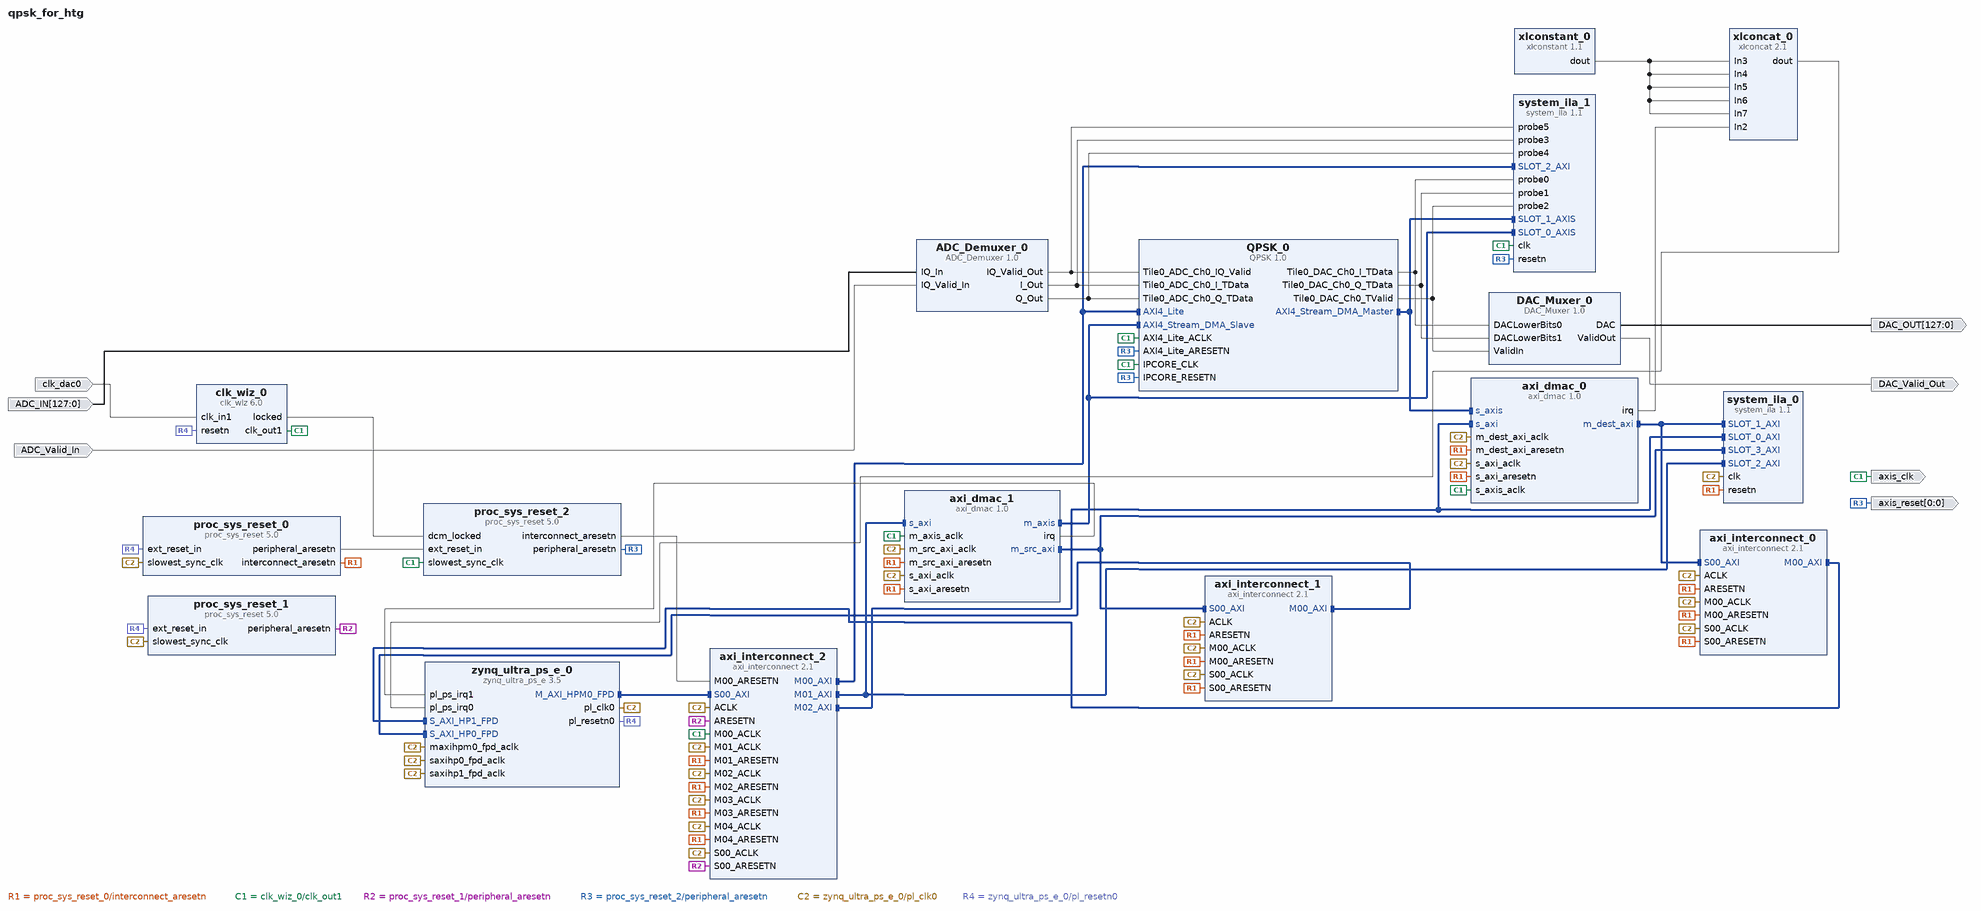
[diagram p0: block diagram of the top level]
# Vivado block design qpsk_for_htg, xczu48dr-ffvg1517-2-e, Vivado 2024.2
create_bd_design qpsk_for_htg

create_bd_port -dir I -type clk clk_dac0
set_property -dict {CONFIG.FREQ_HZ 128000000} [get_bd_ports clk_dac0]
create_bd_port -dir I -from 127 -to 0 ADC_IN
create_bd_port -dir I ADC_Valid_In
create_bd_port -dir O -from 0 -to 0 -type rst axis_reset
create_bd_port -dir O -from 127 -to 0 DAC_OUT
create_bd_port -dir O DAC_Valid_Out
create_bd_port -dir O -type clk axis_clk

create_bd_cell -type ip -vlnv xilinx.com:ip:zynq_ultra_ps_e:3.5 zynq_ultra_ps_e_0
set_property -dict [list \
  CONFIG.PSU__DDR_HIGH_ADDRESS_GUI_ENABLE 0 \
  CONFIG.PSU__MAXIGP0__DATA_WIDTH 128 \
  CONFIG.PSU__USE__IRQ0 1 \
  CONFIG.PSU__USE__IRQ1 1 \
  CONFIG.PSU__USE__M_AXI_GP0 1 \
  CONFIG.PSU__USE__M_AXI_GP2 0 \
  CONFIG.PSU__USE__S_AXI_GP2 1 \
  CONFIG.PSU__USE__S_AXI_GP3 1 \
] [get_bd_cells zynq_ultra_ps_e_0]
# 6 more settings of zynq_ultra_ps_e_0 are not shown: defaults, MIO pin electricals, DDR timing, and values the tool derives
create_bd_cell -type ip -vlnv xilinx.com:ip:axi_interconnect:2.1 axi_interconnect_0
set_property -dict {CONFIG.NUM_MI 1} [get_bd_cells axi_interconnect_0]
create_bd_cell -type ip -vlnv xilinx.com:ip:axi_interconnect:2.1 axi_interconnect_1
set_property -dict {CONFIG.NUM_MI 1} [get_bd_cells axi_interconnect_1]
create_bd_cell -type ip -vlnv xilinx.com:ip:axi_interconnect:2.1 axi_interconnect_2
set_property -dict {CONFIG.NUM_MI 5 CONFIG.NUM_SI 1} [get_bd_cells axi_interconnect_2]
create_bd_cell -type ip -vlnv analog.com:user:axi_dmac:1.0 axi_dmac_0
set_property -dict [list \
  CONFIG.ASYNC_CLK_DEST_REQ false \
  CONFIG.ASYNC_CLK_REQ_SRC true \
  CONFIG.ASYNC_CLK_SRC_DEST true \
  CONFIG.DMA_DATA_WIDTH_DEST 32 \
  CONFIG.DMA_DATA_WIDTH_SRC 32 \
  CONFIG.DMA_TYPE_SRC 1 \
  CONFIG.FIFO_SIZE 32 \
  CONFIG.MAX_BYTES_PER_BURST 512 \
] [get_bd_cells axi_dmac_0]
create_bd_cell -type ip -vlnv fau.edu:ip:QPSK:1.0 QPSK_0
create_bd_cell -type ip -vlnv analog.com:user:axi_dmac:1.0 axi_dmac_1
set_property -dict [list \
  CONFIG.ASYNC_CLK_DEST_REQ true \
  CONFIG.ASYNC_CLK_REQ_SRC false \
  CONFIG.ASYNC_CLK_SRC_DEST true \
  CONFIG.DMA_DATA_WIDTH_DEST 32 \
  CONFIG.DMA_DATA_WIDTH_SRC 32 \
  CONFIG.DMA_TYPE_DEST 1 \
  CONFIG.DMA_TYPE_SRC 0 \
  CONFIG.FIFO_SIZE 32 \
  CONFIG.MAX_BYTES_PER_BURST 512 \
] [get_bd_cells axi_dmac_1]
create_bd_cell -type ip -vlnv xilinx.com:ip:proc_sys_reset:5.0 proc_sys_reset_0
create_bd_cell -type ip -vlnv xilinx.com:ip:proc_sys_reset:5.0 proc_sys_reset_1
create_bd_cell -type ip -vlnv xilinx.com:ip:clk_wiz:6.0 clk_wiz_0
set_property -dict [list \
  CONFIG.CLKIN1_JITTER_PS 100.0 \
  CONFIG.CLKOUT1_JITTER 110.723 \
  CONFIG.CLKOUT1_PHASE_ERROR 87.180 \
  CONFIG.CLKOUT1_REQUESTED_OUT_FREQ 128.000 \
  CONFIG.MMCM_CLKFBOUT_MULT_F 9.375 \
  CONFIG.MMCM_CLKIN1_PERIOD 7.813 \
  CONFIG.MMCM_CLKOUT0_DIVIDE_F 9.375 \
  CONFIG.OVERRIDE_MMCM false \
  CONFIG.RESET_PORT resetn \
  CONFIG.RESET_TYPE ACTIVE_LOW \
] [get_bd_cells clk_wiz_0]
create_bd_cell -type ip -vlnv xilinx.com:ip:xlconcat:2.1 xlconcat_0
set_property -dict {CONFIG.NUM_PORTS 8} [get_bd_cells xlconcat_0]
create_bd_cell -type ip -vlnv xilinx.com:ip:xlconstant:1.1 xlconstant_0
create_bd_cell -type ip -vlnv xilinx.com:ip:proc_sys_reset:5.0 proc_sys_reset_2
create_bd_cell -type ip -vlnv mathworks.com:user:ADC_Demuxer:1.0 ADC_Demuxer_0
set_property -dict {CONFIG.ISGEN3 true} [get_bd_cells ADC_Demuxer_0]
create_bd_cell -type ip -vlnv mathworks.com:user:DAC_Muxer:1.0 DAC_Muxer_0
set_property -dict {CONFIG.SAMPLESPERCLOCK 4} [get_bd_cells DAC_Muxer_0]
create_bd_cell -type ip -vlnv xilinx.com:ip:system_ila:1.1 system_ila_0
set_property -dict [list \
  CONFIG.C_DATA_DEPTH 4096 \
  CONFIG.C_NUM_MONITOR_SLOTS 4 \
  CONFIG.C_SLOT 3 \
  CONFIG.C_SLOT_1_INTF_TYPE xilinx.com:interface:aximm_rtl:1.0 \
  CONFIG.C_SLOT_3_INTF_TYPE xilinx.com:interface:aximm_rtl:1.0 \
] [get_bd_cells system_ila_0]
create_bd_cell -type ip -vlnv xilinx.com:ip:system_ila:1.1 system_ila_1
set_property -dict [list \
  CONFIG.C_DATA_DEPTH 4096 \
  CONFIG.C_MON_TYPE MIX \
  CONFIG.C_NUM_MONITOR_SLOTS 3 \
  CONFIG.C_NUM_OF_PROBES 6 \
  CONFIG.C_SLOT 1 \
  CONFIG.C_SLOT_0_INTF_TYPE xilinx.com:interface:axis_rtl:1.0 \
  CONFIG.C_SLOT_1_INTF_TYPE xilinx.com:interface:axis_rtl:1.0 \
] [get_bd_cells system_ila_1]

# ---- connections ----

connect_bd_intf_net [get_bd_intf_pins QPSK_0/AXI4_Stream_DMA_Master] [get_bd_intf_pins axi_dmac_0/s_axis]
connect_bd_intf_net [get_bd_intf_pins QPSK_0/AXI4_Stream_DMA_Master] [get_bd_intf_pins system_ila_1/SLOT_1_AXIS]
connect_bd_intf_net [get_bd_intf_pins axi_dmac_0/m_dest_axi] [get_bd_intf_pins axi_interconnect_0/S00_AXI]
connect_bd_intf_net [get_bd_intf_pins axi_dmac_0/m_dest_axi] [get_bd_intf_pins system_ila_0/SLOT_1_AXI]
connect_bd_intf_net [get_bd_intf_pins axi_dmac_1/m_axis] [get_bd_intf_pins QPSK_0/AXI4_Stream_DMA_Slave]
connect_bd_intf_net [get_bd_intf_pins axi_dmac_1/m_axis] [get_bd_intf_pins system_ila_1/SLOT_0_AXIS]
connect_bd_intf_net [get_bd_intf_pins axi_dmac_1/m_src_axi] [get_bd_intf_pins axi_interconnect_1/S00_AXI]
connect_bd_intf_net [get_bd_intf_pins axi_dmac_1/m_src_axi] [get_bd_intf_pins system_ila_0/SLOT_3_AXI]
connect_bd_intf_net [get_bd_intf_pins axi_interconnect_0/M00_AXI] [get_bd_intf_pins zynq_ultra_ps_e_0/S_AXI_HP1_FPD]
connect_bd_intf_net [get_bd_intf_pins axi_interconnect_1/M00_AXI] [get_bd_intf_pins zynq_ultra_ps_e_0/S_AXI_HP0_FPD]
connect_bd_intf_net [get_bd_intf_pins QPSK_0/AXI4_Lite] [get_bd_intf_pins axi_interconnect_2/M00_AXI]
connect_bd_intf_net [get_bd_intf_pins QPSK_0/AXI4_Lite] [get_bd_intf_pins system_ila_1/SLOT_2_AXI]
connect_bd_intf_net [get_bd_intf_pins axi_dmac_1/s_axi] [get_bd_intf_pins axi_interconnect_2/M01_AXI]
connect_bd_intf_net [get_bd_intf_pins axi_dmac_1/s_axi] [get_bd_intf_pins system_ila_0/SLOT_2_AXI]
connect_bd_intf_net [get_bd_intf_pins axi_dmac_0/s_axi] [get_bd_intf_pins axi_interconnect_2/M02_AXI]
connect_bd_intf_net [get_bd_intf_pins axi_dmac_0/s_axi] [get_bd_intf_pins system_ila_0/SLOT_0_AXI]
connect_bd_intf_net [get_bd_intf_pins zynq_ultra_ps_e_0/M_AXI_HPM0_FPD] [get_bd_intf_pins axi_interconnect_2/S00_AXI]
connect_bd_net [get_bd_pins ADC_Demuxer_0/IQ_Valid_Out] [get_bd_pins system_ila_1/probe5] [get_bd_pins QPSK_0/Tile0_ADC_Ch0_IQ_Valid]
connect_bd_net [get_bd_pins ADC_Demuxer_0/I_Out] [get_bd_pins system_ila_1/probe3] [get_bd_pins QPSK_0/Tile0_ADC_Ch0_I_TData]
connect_bd_net [get_bd_pins ADC_Demuxer_0/Q_Out] [get_bd_pins system_ila_1/probe4] [get_bd_pins QPSK_0/Tile0_ADC_Ch0_Q_TData]
connect_bd_net -net ARESETN_1 [get_bd_pins proc_sys_reset_0/interconnect_aresetn] \
  [get_bd_pins axi_interconnect_0/ARESETN] [get_bd_pins axi_interconnect_0/S00_ARESETN] \
  [get_bd_pins axi_interconnect_0/M00_ARESETN] [get_bd_pins axi_interconnect_2/M01_ARESETN] \
  [get_bd_pins axi_interconnect_2/M02_ARESETN] [get_bd_pins axi_interconnect_2/M03_ARESETN] \
  [get_bd_pins axi_interconnect_2/M04_ARESETN] [get_bd_pins axi_interconnect_1/M00_ARESETN] \
  [get_bd_pins axi_interconnect_1/S00_ARESETN] [get_bd_pins axi_interconnect_1/ARESETN] \
  [get_bd_pins axi_dmac_0/m_dest_axi_aresetn] [get_bd_pins axi_dmac_0/s_axi_aresetn] [get_bd_pins system_ila_0/resetn] \
  [get_bd_pins axi_dmac_1/s_axi_aresetn] [get_bd_pins axi_dmac_1/m_src_axi_aresetn]
connect_bd_net [get_bd_pins DAC_Muxer_0/DAC] [get_bd_ports DAC_OUT]
connect_bd_net [get_bd_pins DAC_Muxer_0/ValidOut] [get_bd_ports DAC_Valid_Out]
connect_bd_net -net IQ_In_0_1 [get_bd_ports ADC_IN] [get_bd_pins ADC_Demuxer_0/IQ_In]
connect_bd_net -net IQ_Valid_In_0_1 [get_bd_ports ADC_Valid_In] [get_bd_pins ADC_Demuxer_0/IQ_Valid_In]
connect_bd_net -net M00_ARESETN_1 [get_bd_pins proc_sys_reset_2/interconnect_aresetn] [get_bd_pins axi_interconnect_2/M00_ARESETN]
connect_bd_net [get_bd_pins QPSK_0/Tile0_DAC_Ch0_I_TData] [get_bd_pins DAC_Muxer_0/DACLowerBits0] [get_bd_pins system_ila_1/probe0]
connect_bd_net [get_bd_pins QPSK_0/Tile0_DAC_Ch0_Q_TData] [get_bd_pins DAC_Muxer_0/DACLowerBits1] [get_bd_pins system_ila_1/probe1]
connect_bd_net [get_bd_pins QPSK_0/Tile0_DAC_Ch0_TValid] [get_bd_pins DAC_Muxer_0/ValidIn] [get_bd_pins system_ila_1/probe2]
connect_bd_net [get_bd_pins axi_dmac_0/irq] [get_bd_pins xlconcat_0/In2]
connect_bd_net [get_bd_pins axi_dmac_1/irq] [get_bd_pins zynq_ultra_ps_e_0/pl_ps_irq1]
connect_bd_net -net clk_in1_0_1 [get_bd_ports clk_dac0] [get_bd_pins clk_wiz_0/clk_in1]
connect_bd_net [get_bd_pins clk_wiz_0/clk_out1] \
  [get_bd_ports axis_clk] [get_bd_pins axi_dmac_1/m_axis_aclk] [get_bd_pins axi_dmac_0/s_axis_aclk] \
  [get_bd_pins proc_sys_reset_2/slowest_sync_clk] [get_bd_pins axi_interconnect_2/M00_ACLK] [get_bd_pins system_ila_1/clk] \
  [get_bd_pins QPSK_0/IPCORE_CLK] [get_bd_pins QPSK_0/AXI4_Lite_ACLK]
connect_bd_net [get_bd_pins clk_wiz_0/locked] [get_bd_pins proc_sys_reset_2/dcm_locked]
connect_bd_net [get_bd_pins proc_sys_reset_0/peripheral_aresetn] [get_bd_pins proc_sys_reset_2/ext_reset_in]
connect_bd_net [get_bd_pins proc_sys_reset_1/peripheral_aresetn] [get_bd_pins axi_interconnect_2/ARESETN] [get_bd_pins axi_interconnect_2/S00_ARESETN]
connect_bd_net [get_bd_pins proc_sys_reset_2/peripheral_aresetn] \
  [get_bd_ports axis_reset] [get_bd_pins system_ila_1/resetn] [get_bd_pins QPSK_0/IPCORE_RESETN] \
  [get_bd_pins QPSK_0/AXI4_Lite_ARESETN]
connect_bd_net [get_bd_pins xlconcat_0/dout] [get_bd_pins zynq_ultra_ps_e_0/pl_ps_irq0]
connect_bd_net [get_bd_pins xlconstant_0/dout] \
  [get_bd_pins xlconcat_0/In3] [get_bd_pins xlconcat_0/In4] [get_bd_pins xlconcat_0/In5] [get_bd_pins xlconcat_0/In6] \
  [get_bd_pins xlconcat_0/In7]
connect_bd_net [get_bd_pins zynq_ultra_ps_e_0/pl_clk0] \
  [get_bd_pins axi_interconnect_2/ACLK] [get_bd_pins axi_interconnect_2/S00_ACLK] [get_bd_pins axi_interconnect_2/M01_ACLK] \
  [get_bd_pins axi_interconnect_2/M02_ACLK] [get_bd_pins axi_interconnect_2/M03_ACLK] \
  [get_bd_pins proc_sys_reset_1/slowest_sync_clk] [get_bd_pins axi_interconnect_2/M04_ACLK] \
  [get_bd_pins zynq_ultra_ps_e_0/saxihp0_fpd_aclk] [get_bd_pins zynq_ultra_ps_e_0/saxihp1_fpd_aclk] \
  [get_bd_pins axi_interconnect_0/ACLK] [get_bd_pins axi_interconnect_0/S00_ACLK] [get_bd_pins axi_interconnect_0/M00_ACLK] \
  [get_bd_pins axi_interconnect_1/ACLK] [get_bd_pins axi_interconnect_1/M00_ACLK] [get_bd_pins axi_interconnect_1/S00_ACLK] \
  [get_bd_pins axi_dmac_0/s_axi_aclk] [get_bd_pins axi_dmac_0/m_dest_axi_aclk] [get_bd_pins axi_dmac_1/s_axi_aclk] \
  [get_bd_pins axi_dmac_1/m_src_axi_aclk] [get_bd_pins proc_sys_reset_0/slowest_sync_clk] [get_bd_pins system_ila_0/clk] \
  [get_bd_pins zynq_ultra_ps_e_0/maxihpm0_fpd_aclk]
connect_bd_net [get_bd_pins zynq_ultra_ps_e_0/pl_resetn0] \
  [get_bd_pins proc_sys_reset_1/ext_reset_in] [get_bd_pins proc_sys_reset_0/ext_reset_in] [get_bd_pins clk_wiz_0/resetn]

# ---- address map ----
assign_bd_address -offset 0x00000000 -range 2G -target_address_space [get_bd_addr_spaces axi_dmac_0/m_dest_axi] [get_bd_addr_segs zynq_ultra_ps_e_0/SAXIGP3/HP1_DDR_LOW]
assign_bd_address -offset 0xFF000000 -range 16M -target_address_space [get_bd_addr_spaces axi_dmac_0/m_dest_axi] [get_bd_addr_segs zynq_ultra_ps_e_0/SAXIGP3/HP1_LPS_OCM]
assign_bd_address -offset 0x00000000 -range 2G -target_address_space [get_bd_addr_spaces axi_dmac_1/m_src_axi] [get_bd_addr_segs zynq_ultra_ps_e_0/SAXIGP2/HP0_DDR_LOW]
assign_bd_address -offset 0xFF000000 -range 16M -target_address_space [get_bd_addr_spaces axi_dmac_1/m_src_axi] [get_bd_addr_segs zynq_ultra_ps_e_0/SAXIGP2/HP0_LPS_OCM]
assign_bd_address -offset 0x00A0000000 -range 64K -target_address_space [get_bd_addr_spaces zynq_ultra_ps_e_0/Data] [get_bd_addr_segs QPSK_0/AXI4_Lite/reg0]
assign_bd_address -offset 0x00A0020000 -range 64K -target_address_space [get_bd_addr_spaces zynq_ultra_ps_e_0/Data] [get_bd_addr_segs axi_dmac_0/s_axi/axi_lite]
assign_bd_address -offset 0x00A0030000 -range 64K -target_address_space [get_bd_addr_spaces zynq_ultra_ps_e_0/Data] [get_bd_addr_segs axi_dmac_1/s_axi/axi_lite]

validate_bd_design
save_bd_design
